# Altium schematic sheet relay.SchDoc
size A4
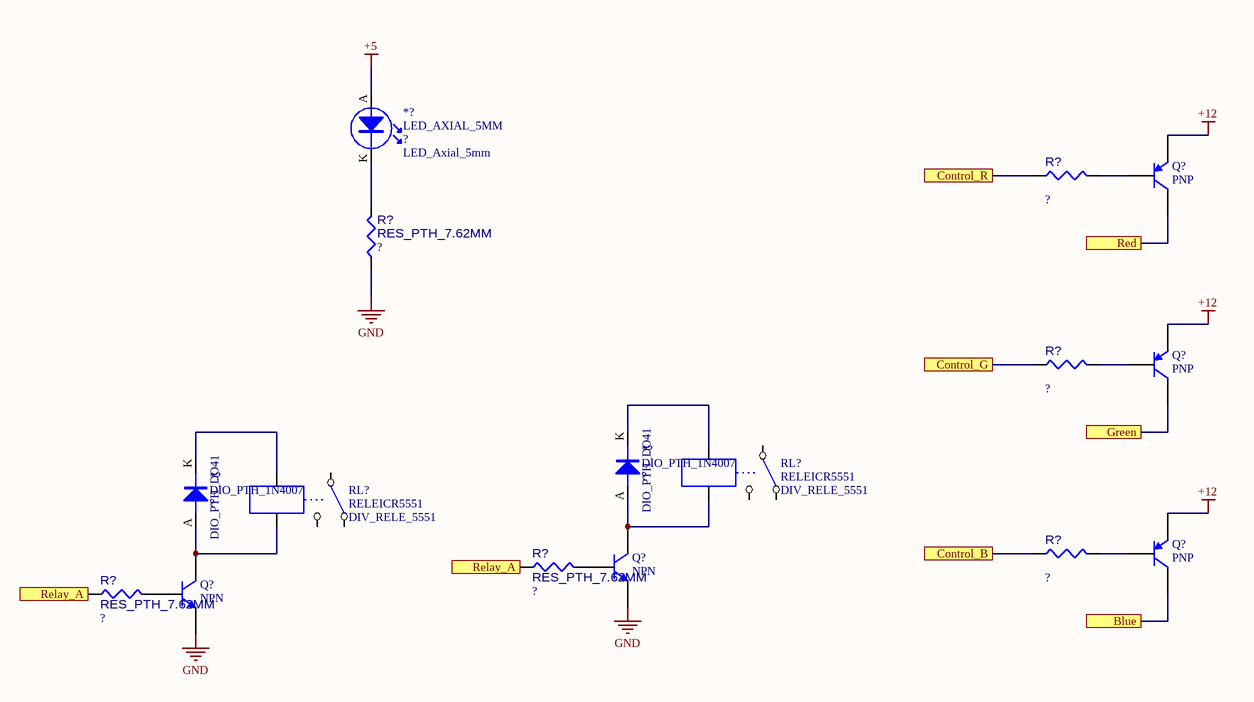
[diagram p0: relay.SchDoc]

## Parts
(Parts that share a designator on the sheet are numbered #1, #2 ... from top to bottom, then left to right.)
*?#1  LED_AXIAL_5MM  [LED_Axial_5mm]
*?#2  DIO_PTH_1N4007  [DIO_PTH_DO41]
*?#3  DIO_PTH_1N4007  [DIO_PTH_DO41]
Q?#1  PNP  [SOT-23B_L]
Q?#2  PNP  [SOT-23B_L]
Q?#3  PNP  [SOT-23B_L]
Q?#4  NPN  [TO-226-AA]
Q?#5  NPN  [TO-226-AA]
R?#1  ?  [RES_PTH_7.62MM]
R?#2  ?  [RES_PTH_7.62MM]
R?#3  ?  [RES_PTH_7.62MM]
R?#4  ?  [RES_PTH_7.62MM]
R?#5  ?  [RES_PTH_7.62MM]
R?#6  ?  [RES_PTH_7.62MM]
RL?#1  RELEICR5551  [DIV_RELE_5551]
RL?#2  RELEICR5551  [DIV_RELE_5551]

## Ports
Blue, Control_B, Control_G, Control_R, Green, Red, Relay_A

## Nets
+5: *?#1.A
+12: Q?#1.3(E) Q?#2.3(E) Q?#3.3(E)
GND: Q?#4.3(E) Q?#5.3(E) R?#2.1
Blue: Q?#3.1(C) ; port Blue
Control_B: R?#4.1 ; port Control_B
Control_G: R?#3.1 ; port Control_G
Control_R: R?#1.1 ; port Control_R
Green: Q?#2.1(C) ; port Green
Red: Q?#1.1(C) ; port Red
Relay_A: R?#5.1 R?#6.1 ; port Relay_A
Net*?#1_K: *?#1.K R?#2.2
Net*?#2_A: *?#2.A Q?#4.1(C) RL?#1.5
Net*?#2_K: *?#2.K RL?#1.4
Net*?#3_A: *?#3.A Q?#5.1(C) RL?#2.5
Net*?#3_K: *?#3.K RL?#2.4
NetQ?#1_2: Q?#1.2(B) R?#1.2
NetQ?#2_2: Q?#2.2(B) R?#3.2
NetQ?#3_2: Q?#3.2(B) R?#4.2
NetQ?#4_2: Q?#4.2(B) R?#5.2
NetQ?#5_2: Q?#5.2(B) R?#6.2

Not connected (* = marked no-connect by the designer): RL?#1 1 2 3; RL?#2 1 2 3

## Library data of the parts
Q?#1-Q?#3 = PNP: PNP Bipolar Transistor; Published: 8-Jun-2000; LatestRevisionDate: 29-May-2009; LatestRevisionNote: IPC-7351 Footprint Added.; PackageVersion: Aug-1999; PackageReference: SOT-23B; Publisher: Altium Limited; PackageDescription: 3-Pin SOT-23 Package 0.95 mm Pitch, 2.4 mm Lead Span
Q?#4 Q?#5 = NPN: NPN Bipolar Transistor; Published: 8-Jun-2000; LatestRevisionDate: 17-Jul-2002; LatestRevisionNote: Re-released for DXP Platform.; PackageReference: TO-226-AA; Publisher: Altium Limited; PackageDescription: TO, Flat Index; 3 In-Line, Axial Leads; Body Dia. 4.8mm; Leads 0.55 x 0.51 mm (max); Code_JEDEC: TO-226-AA
R?#1-R?#6 = RES_PTH_7.62MM: Pin Through Hole Resistor 7.62mm; Value: ?
*?#1 = LED_AXIAL_5MM: Value: ?
*?#2 *?#3 = DIO_PTH_1N4007: Value: ?
RL?#1 RL?#2 = RELEICR5551: Value: RELEICR5551